# EAGLE schematic schematic (EAGLE 9.6.2)
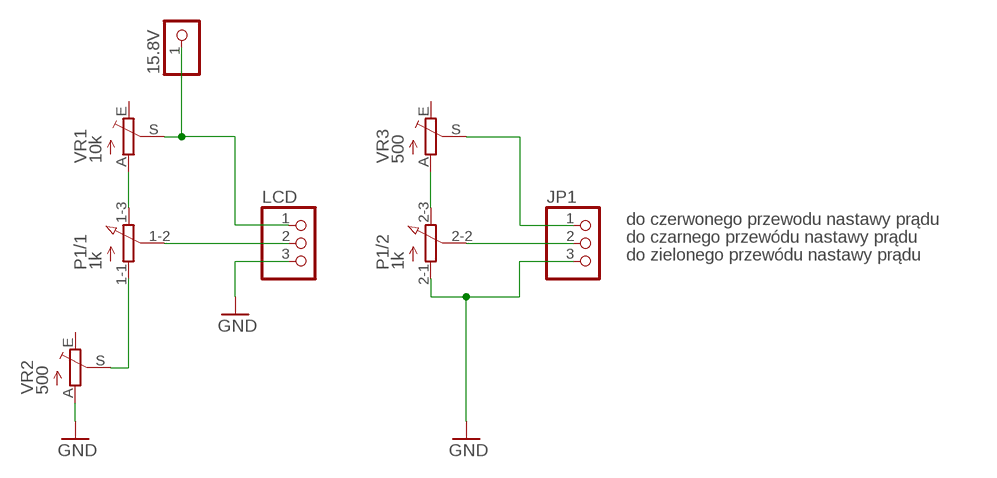
[diagram p0: schematic, sheet 1]

## Parts
15.8V  PINHD-1X1  [1X01]
JP1  PINHD-1X3  [1X03]
LCD  PINHD-1X3  [1X03]
P1  1k  3RP/1610G  [3RP/1610G]
VR1  10k  TRIM_EU-RJ9W  [RJ9W]
VR2  500  TRIM_EU-RJ9W  [RJ9W]
VR3  500  TRIM_EU-RJ9W  [RJ9W]

## Nets
GND: JP1.3 LCD.3 P1.2-1(/2:A) VR2.A
N$1: P1.2-3(/2:E) VR3.A
N$2: JP1.1 VR3.S
N$3: JP1.2 P1.2-2(/2:S)
N$4: P1.1-1(/1:A) VR2.S
N$5: P1.1-3(/1:E) VR1.A
N$6: 15.8V.1 LCD.1 VR1.S
N$8: LCD.2 P1.1-2(/1:S)
Unconnected: VR1.E VR2.E VR3.E

## Notes on the sheet
- do czerwonego przewodu nastawy prądu
- do czarnego przewódu nastawy prądu
- do zielonego przewódu nastawy prądu

## Library data of the parts
15.8V = pinhead:PINHD-1X1: PIN HEADER
JP1 LCD = pinhead:PINHD-1X3: PIN HEADER
P1 = pot:3RP/1610G: 16mm Potentiometer two level Source: http://www.alphapotentiometers.net/html/16mm_pot_2.html
VR1-VR3 = pot:TRIM_EU-: POTENTIOMETER